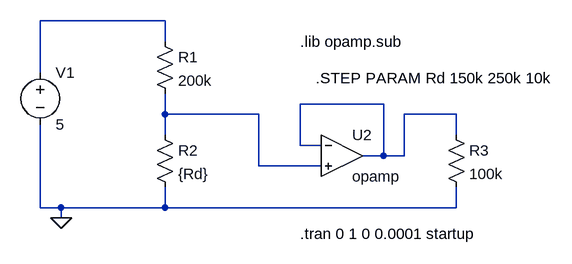
[diagram p0: schematic T4_5_opamp_range.asc]
T4_5_opamp_range.asc, the LTspice schematic file:
Version 4
SHEET 1 880 680
WIRE 128 -112 -64 -112
WIRE 128 -80 128 -112
WIRE -64 -32 -64 -112
WIRE 464 16 336 16
WIRE 128 32 128 0
WIRE 272 32 128 32
WIRE 576 32 496 32
WIRE 128 64 128 32
WIRE 576 64 576 32
WIRE 336 80 336 16
WIRE 368 80 336 80
WIRE 464 96 464 16
WIRE 464 96 432 96
WIRE 496 96 496 32
WIRE 496 96 464 96
WIRE 272 112 272 32
WIRE 368 112 272 112
WIRE -64 176 -64 48
WIRE -32 176 -64 176
WIRE 128 176 128 144
WIRE 128 176 -32 176
WIRE 576 176 576 144
WIRE 576 176 128 176
WIRE -32 192 -32 176
FLAG -32 192 0
SYMBOL voltage -64 -48 R0
WINDOW 123 0 0 Left 0
WINDOW 39 0 0 Left 0
SYMATTR InstName V1
SYMATTR Value 5
SYMBOL res 112 -96 R0
SYMATTR InstName R1
SYMATTR Value 200k
SYMBOL res 112 48 R0
SYMATTR InstName R2
SYMATTR Value {Rd}
SYMBOL res 560 48 R0
SYMATTR InstName R3
SYMATTR Value 100k
SYMBOL OpAmps\\opamp 400 32 R0
SYMATTR InstName U2
TEXT 336 -80 Left 2 !.lib opamp.sub
TEXT 336 216 Left 2 !.tran 0 1 0 0.0001 startup
TEXT 360 -24 Left 2 !.STEP PARAM Rd 150k 250k 10k

The netlist it stands for:
* T4_5_opamp_range.asc
V1 N001 0 5
R1 N001 N003 200k
R2 N003 0 {Rd}
R3 N002 0 100k
XU2 N002 N003 N002 opamp Aol=100K GBW=10Meg  ; pins invin noninvin out
.lib opamp.sub
.tran 0 1 0 0.0001 startup
.STEP PARAM Rd 150k 250k 10k
.backanno
.end